# EAGLE schematic Tape (EAGLE 9.6.2)
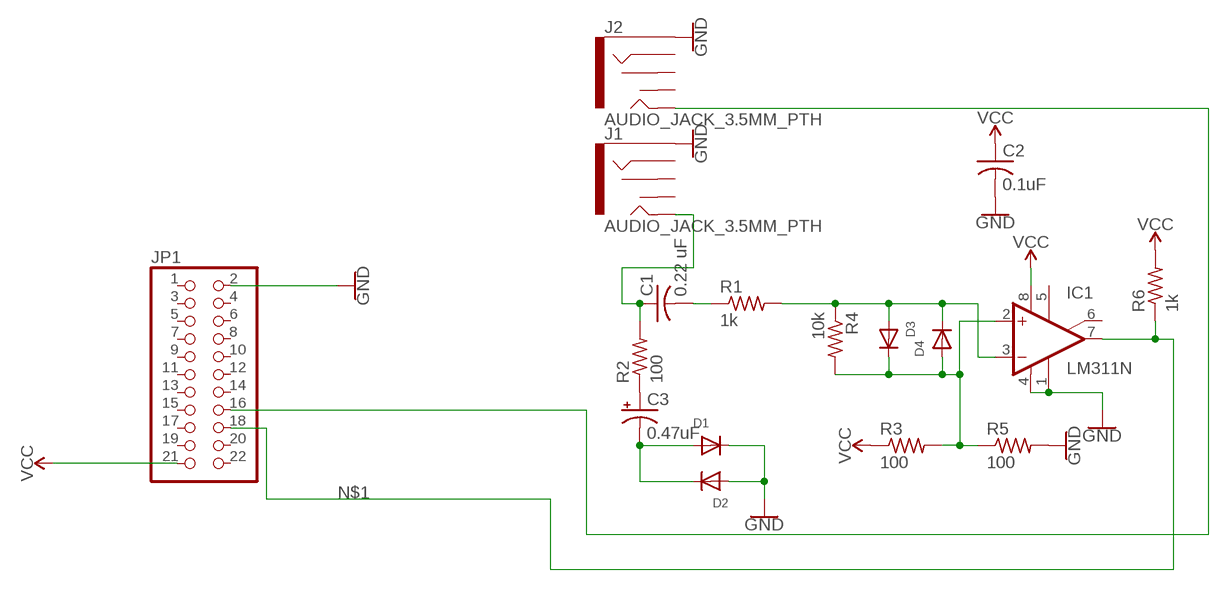
[diagram p0: schematic, sheet 1]

## Parts
C1  0.22 uF  C-US025-030X050  [C025-030X050]
C2  0.1uF  C-US025-030X050  [C025-030X050]
C3  0.47uF  CPOL-USE2.5-5  [E2,5-5]
D1  DIODEDO-1N4148  [DO-1N4148]
D2  DIODEDO-1N4148  [DO-1N4148]
D3  DIODEDO-1N4148  [DO-1N4148]
D4  DIODEDO-1N4148  [DO-1N4148]
IC1  LM311N  [DIL08]
J1  AUDIO_JACK_3.5MM_PTH  [AUDIO-JACK]
J2  AUDIO_JACK_3.5MM_PTH  [AUDIO-JACK]
JP1  PINHD-2X11/90  [2X11/90]
R1  1k  R-US_0204/7  [0204/7]
R2  100  R-US_0204/7  [0204/7]
R3  100  R-US_0204/7  [0204/7]
R4  10k  R-US_0204/7  [0204/7]
R5  100  R-US_0204/7  [0204/7]
R6  1k  R-US_0204/7  [0204/7]

## Nets
18: J2.TIP JP1.16
GND: C2.2 D1.C D2.A IC1.1(GND) IC1.4(V-) J1.SLEEVE J2.SLEEVE JP1.2 R5.2
N$1: IC1.7(OUT) JP1.18 R6.1
N$2: C1.2 R1.1
N$3: C3.- D1.A D2.C
N$4: C3.+ R2.1
N$21: D3.A D4.C IC1.3(-IN) R1.2 R4.1
N$22: D3.C D4.A IC1.2(+IN) R3.2 R4.2 R5.1
N$23: C1.1 J1.TIP R2.2
VCC: C2.1 IC1.8(V+) JP1.21 R3.1 R6.2
Unconnected: IC1.5(ON) IC1.6(ON/STR) J1.RING J1.RSH J1.TSH J2.RING J2.RSH J2.TSH JP1.1 JP1.3 JP1.4 JP1.5 JP1.6 JP1.7 JP1.8 JP1.9 JP1.10 JP1.11 JP1.12 JP1.13 JP1.14 JP1.15 JP1.17 JP1.19 JP1.20 JP1.22

## Library data of the parts
C1 C2 = adafruit:C-US: CAPACITOR, American symbol
C3 = adafruit:CPOL-US: POLARIZED CAPACITOR, American symbol
D1-D4 = adafruit:DIODE: Diode SMADIODE - SMA Surface Mount Package 20V 1A Schottky Diode Digikey: 641-1014-6-ND DO-1N4148 - Through Hole Small Current Diode SOD-123 20V 1 A (.5mV Vf) Schottky Diode - Digikey: MBRX120TPMSCT-ND SOD-323 10V 570mA (.38mV Vf, 3ns) Schottky Diode - Digikey: ZLLS410CT-ND SOD-523 30V 30mA Schottky Diode (RB751S-40TE61) - Digikey: RB751S-40TE61CT-ND SOT23-R/W - SOT23 Package (R = Solder Paste/Reflow Ovens, W = Hand-Soldering) BAT54Film 40V 300mA - Digikey: 497-7162-1-ND
IC1 = linear:LM311: COMPARATOR
J1 J2 = SparkFun-Connectors:AUDIO_JACK_3.5MM: Audio Jack 3.5mm variants of PTH and SMT stereo audio jack with bypass switches. SparkFun Products: SparkFun SparkPunk Sound Kit <[https://www.sparkfun.com/products/11177]> - PTH MP3 Trigger <https://www.sparkfun.com/products/13720> -3.5mm SMD SparkFun PicoBoard <https://www.sparkfun.com/products/11888>- 2.5mm SMD; PROD_ID: CONN-08774; SF_ID: PRT-08032
JP1 = pinhead:PINHD-2X11: PIN HEADER
R1-R6 = adafruit:R-US_: RESISTOR, American symbol